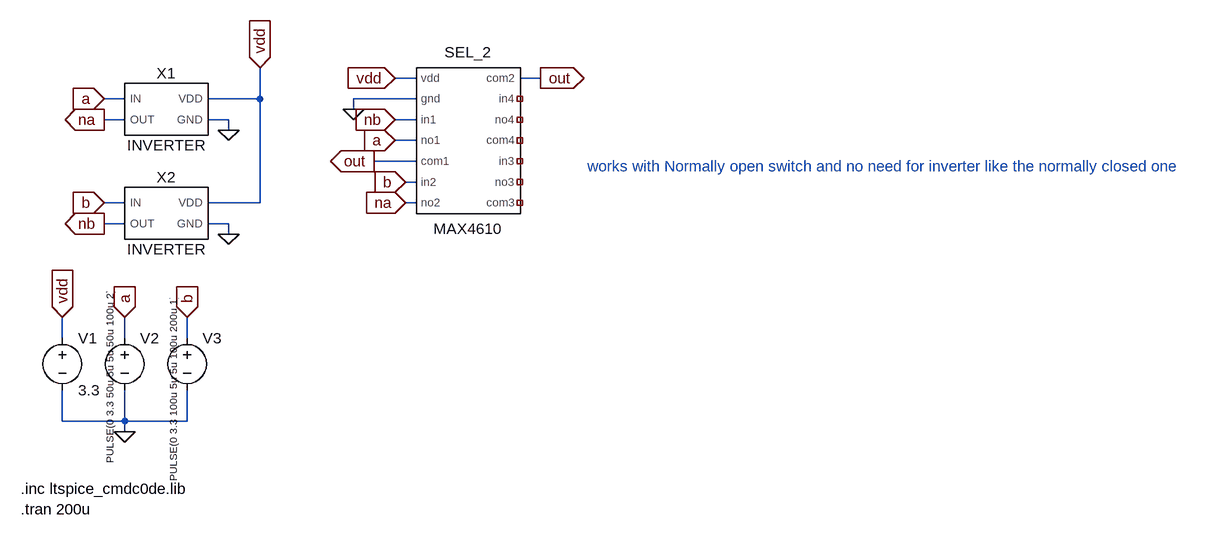
[diagram p0: schematic xor_max4610.asc]
xor_max4610.asc, the LTspice schematic file:
Version 4.1
SHEET 1 1704 1020
WIRE 432 48 400 48
WIRE 624 48 592 48
WIRE -16 80 -48 80
WIRE 192 80 192 32
WIRE 192 80 112 80
WIRE 432 80 336 80
WIRE 336 96 336 80
WIRE -16 112 -48 112
WIRE 144 112 112 112
WIRE 432 112 400 112
WIRE 144 128 144 112
WIRE 432 144 400 144
WIRE 432 176 368 176
WIRE 432 208 416 208
WIRE -16 240 -48 240
WIRE 192 240 192 80
WIRE 192 240 112 240
WIRE 432 240 416 240
WIRE -16 272 -48 272
WIRE 144 272 112 272
WIRE 144 288 144 272
WIRE -112 448 -112 416
WIRE -16 448 -16 416
WIRE 80 448 80 416
WIRE -112 576 -112 528
WIRE -16 576 -16 528
WIRE -16 576 -112 576
WIRE 80 576 80 528
WIRE 80 576 -16 576
WIRE -16 592 -16 576
FLAG -48 80 a
IOPIN -48 80 In
FLAG -48 112 na
IOPIN -48 112 Out
FLAG 144 128 0
FLAG 144 288 0
FLAG -48 240 b
IOPIN -48 240 In
FLAG -48 272 nb
IOPIN -48 272 Out
FLAG -16 592 0
FLAG -112 416 vdd
IOPIN -112 416 In
FLAG -16 416 a
IOPIN -16 416 In
FLAG 80 416 b
IOPIN 80 416 In
FLAG 192 32 vdd
IOPIN 192 32 In
FLAG 336 96 0
FLAG 400 48 vdd
IOPIN 400 48 In
FLAG 400 112 nb
IOPIN 400 112 In
FLAG 400 144 a
IOPIN 400 144 In
FLAG 368 176 out
IOPIN 368 176 Out
FLAG 416 208 b
IOPIN 416 208 In
FLAG 416 240 na
IOPIN 416 240 In
FLAG 624 48 out
IOPIN 624 48 Out
SYMBOL inverter 48 96 R0
SYMATTR InstName X1
SYMATTR SpiceModel ""
SYMBOL inverter 48 256 R0
SYMATTR InstName X2
SYMATTR SpiceModel ""
SYMBOL voltage -112 432 R0
WINDOW 123 0 0 Left 0
WINDOW 39 0 0 Left 0
SYMATTR InstName V1
SYMATTR Value 3.3
SYMBOL voltage -16 432 R0
WINDOW 3 -23 209 VLeft 1
WINDOW 123 0 0 Left 0
WINDOW 39 0 0 Left 0
SYMATTR Value PULSE(0 3.3 50u 5u 5u 50u 100u 2)
SYMATTR InstName V2
SYMBOL voltage 80 432 R0
WINDOW 3 -21 237 VLeft 1
WINDOW 123 0 0 Left 0
WINDOW 39 0 0 Left 0
SYMATTR Value PULSE(0 3.3 100u 5u 5u 100u 200u 1)
SYMATTR InstName V3
SYMBOL MAX4610 512 144 R0
SYMATTR InstName SEL_2
TEXT -176 680 Left 2 !.inc ltspice_cmdc0de.lib\n.tran 200u
TEXT 696 184 Left 2 ;works with Normally open switch and no need for inverter like the normally closed one

The netlist it stands for:
* xor_max4610.asc
X§X1 a na vdd 0 INVERTER  ; pins IN OUT VDD GND
X§X2 b nb vdd 0 INVERTER  ; pins IN OUT VDD GND
V1 vdd 0 3.3
V2 a 0 PULSE(0 3.3 50u 5u 5u 50u 100u 2)
V3 b 0 PULSE(0 3.3 100u 5u 5u 100u 200u 1)
X§SEL_2 vdd 0 nb a out b na out NC_01 NC_02 NC_03 NC_04 NC_05 NC_06 MAX4610  ; pins vdd gnd in1 no1 com1 in2 no2 com2 in4 no4 com4 in3 no3 com3
.inc ltspice_cmdc0de.lib
.tran 200u
* works with Normally open switch and no need for inverter like the normally closed one
.lib yap_cells.lib
.lib ltspice_cmdc0de.lib
.backanno
.end